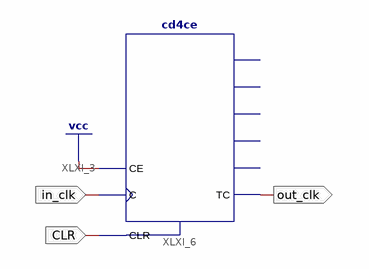
[diagram p0: schematic sheet 1]
// Xilinx ISE schematic DividerBy10.sch (spartan6) as structural Verilog: 1 symbols, 3 ports
module DividerBy10 (
  input  in_clk,
  input  CLR,
  output out_clk
);

  cd4ce XLXI_6 (.C(in_clk), .CE(1'b1), .CLR(CLR), .TC(out_clk));  // open: CEO, Q0, Q1, Q2, Q3
endmodule
